# EAGLE design tiny (EAGLE 6.1)

## Sheet 1 of 2
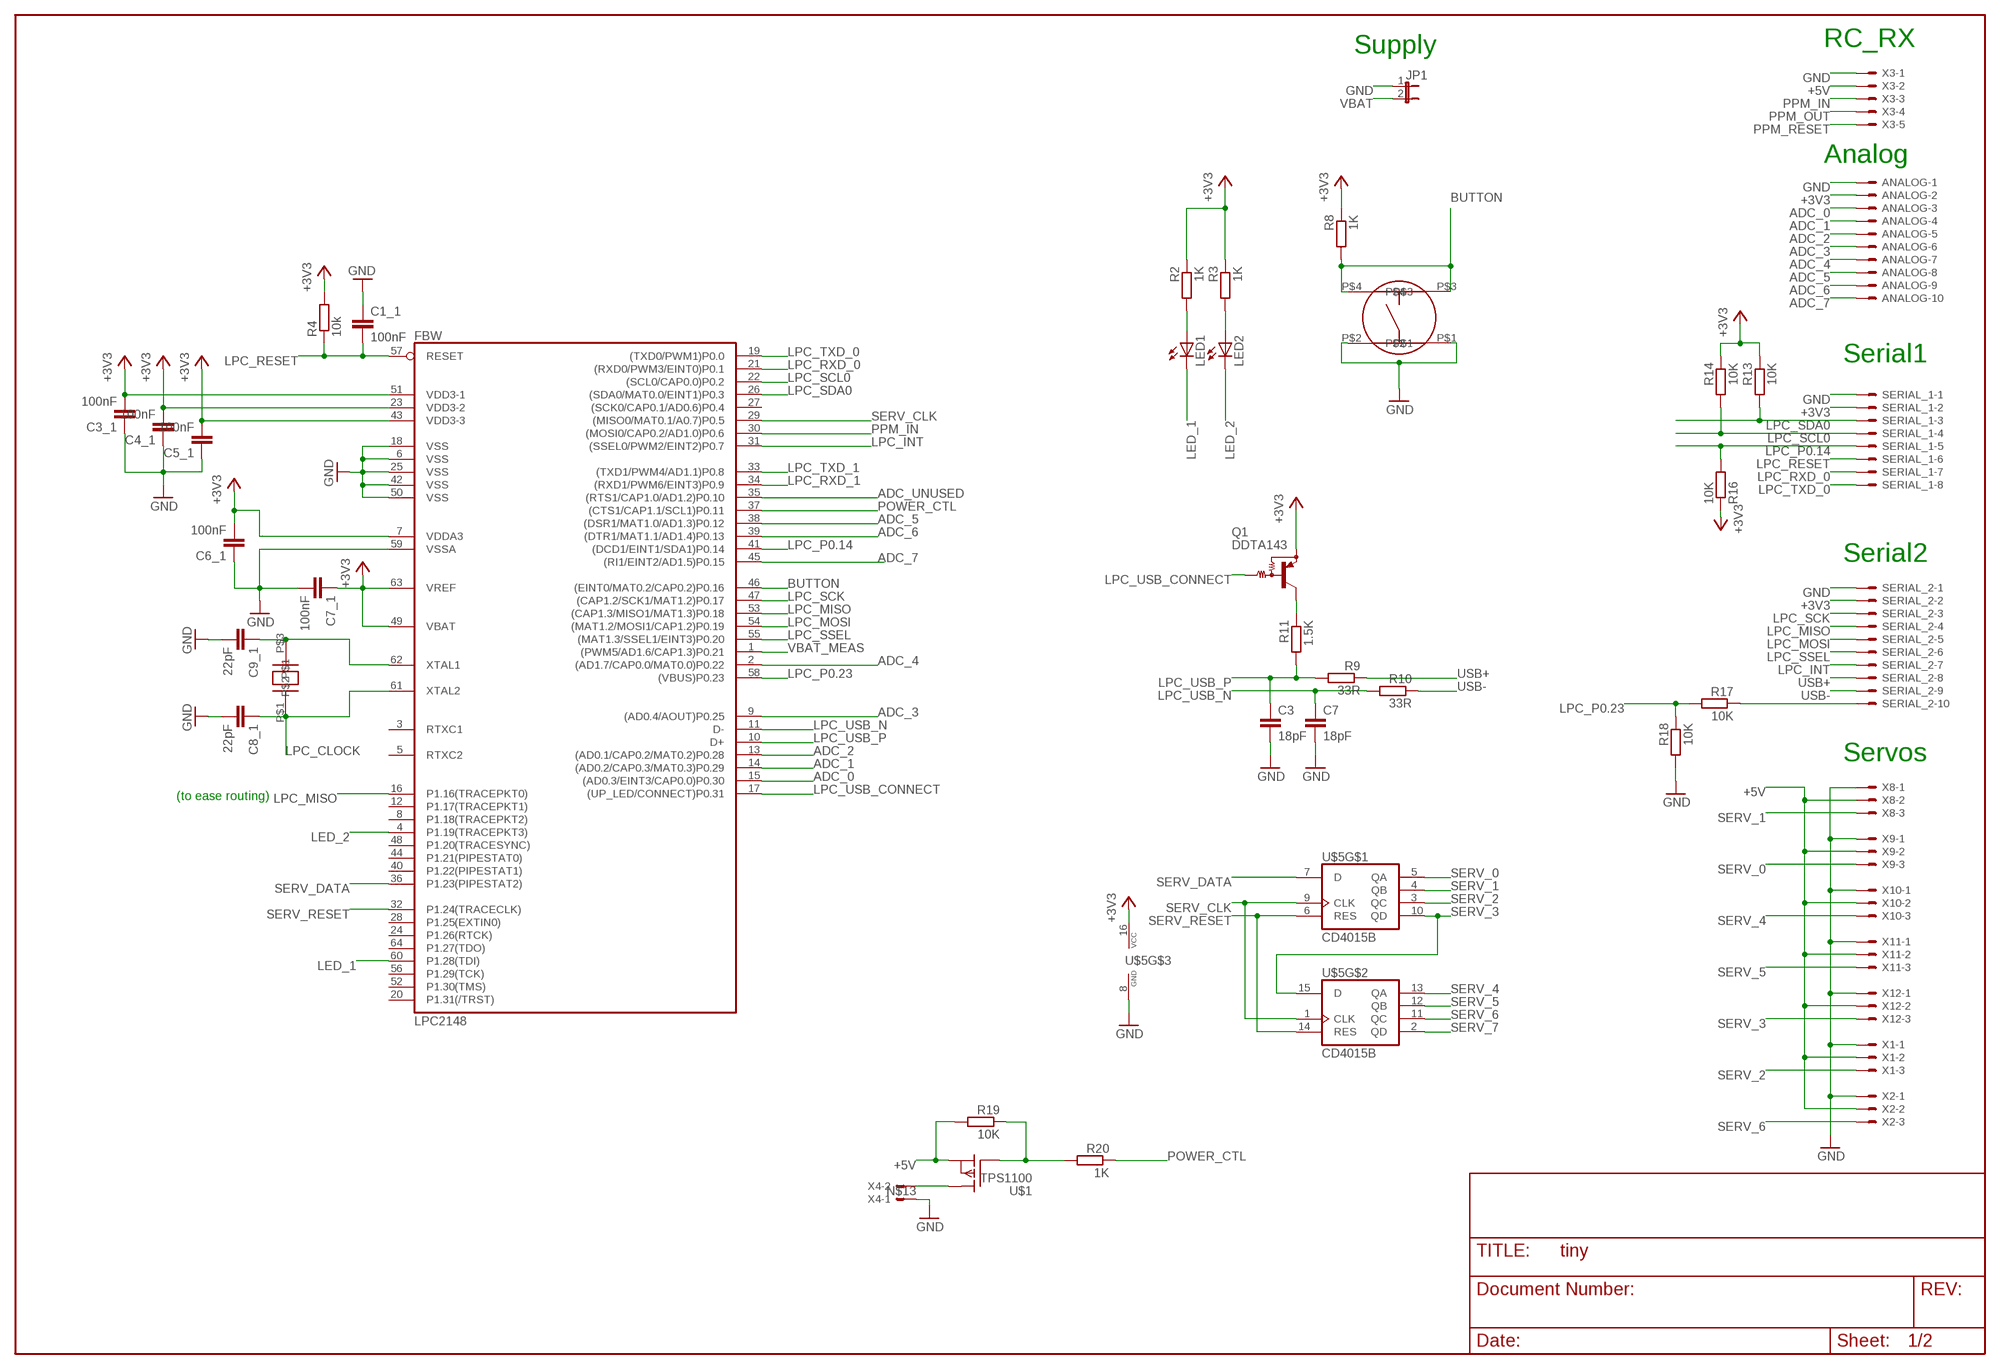
[diagram p0: schematic, sheet 1]

### Parts
ANALOG  53047-10  [53047-10]
C1_1  100nF  C-EUC0402K  [C0402K]
C3  18pF  C-EUC0402K  [C0402K]
C3_1  100nF  C-EUC0402K  [C0402K]
C4_1  100nF  C-EUC0402K  [C0402K]
C5_1  100nF  C-EUC0402K  [C0402K]
C6_1  100nF  C-EUC0402K  [C0402K]
C7  18pF  C-EUC0402K  [C0402K]
C7_1  100nF  C-EUC0402K  [C0402K]
C8_1  22pF  C-EUC0402K  [C0402K]
C9_1  22pF  C-EUC0402K  [C0402K]
FBW  LPC2148  [SQFP-S-10X10-64]
JP1  JP1E  [JP1]
LED1  LEDCHIP-LED0805  [CHIP-LED0805]
LED2  LEDCHIP-LED0805  [CHIP-LED0805]
Q1  DDTA143  MUN2111T1  [SC59-BEC]
R2  1K  R-EU_R1005  [R1005]
R3  1K  R-EU_R1005  [R1005]
R4  10k  R-EU_R1005  [R1005]
R8  1K  R-EU_R1005  [R1005]
R9  33R  R-EU_R1005  [R1005]
R10  33R  R-EU_R1005  [R1005]
R11  1.5K  R-EU_R1005  [R1005]
R13  10K  R-EU_R1005  [R1005]
R14  10K  R-EU_R1005  [R1005]
R16  10K  R-EU_R1005  [R1005]
R17  10K  R-EU_R1005  [R1005]
R18  10K  R-EU_R1005  [R1005]
R19  10K  R-EU_R1005  [R1005]
R20  1K  R-EU_R1005  [R1005]
SERIAL_1  53047-08  [53047-08]
SERIAL_2  53047-10  [53047-10]
SW1  B3S  [B3S]
U$1  TPS1100  [SOIC8]
U$5  CD4015B  [TSSOP16]
U$19  CRYSTAL_CTS  [CTS_CRYSTAL]
X1  53047-03  [53047-03]
X2  53047-03  [53047-03]
X3  53047-05  [53047-05]
X4  53047-02  [53047-02]
X8  53047-03  [53047-03]
X9  53047-03  [53047-03]
X10  53047-03  [53047-03]
X11  53047-03  [53047-03]
X12  53047-03  [53047-03]

### Nets
+3V3: ANALOG.2 C3_1.2 C4_1.2 C5_1.2 C6_1.2 C7_1.1 FBW.7(VDDA3) FBW.23(VDD3-2) FBW.43(VDD3-3) FBW.49(VBAT) FBW.51(VDD3-1) FBW.63(VREF) Q1.E R2.1 R3.1 R4.2 R8.1 R13.1 R14.1 R16.1 SERIAL_1.2 SERIAL_2.2 U$5.16(VCC) ; also sheet 2
+5V: R19.2 U$1.1(S) X1.2 X2.2 X3.2 X8.2 X9.2 X10.2 X11.2 X12.2 ; also sheet 2
ADC_0: ANALOG.3 FBW.15((AD0.3/EINT3/CAP0.0)P0.30)
ADC_1: ANALOG.4 FBW.14((AD0.2/CAP0.3/MAT0.3)P0.29)
ADC_2: ANALOG.5 FBW.13((AD0.1/CAP0.2/MAT0.2)P0.28)
ADC_3: ANALOG.6 FBW.9((AD0.4/AOUT)P0.25)
ADC_4: ANALOG.7 FBW.2((AD1.7/CAP0.0/MAT0.0)P0.22)
ADC_5: ANALOG.8 FBW.38((DSR1/MAT1.0/AD1.3)P0.12)
ADC_6: ANALOG.9 FBW.39((DTR1/MAT1.1/AD1.4)P0.13)
ADC_7: ANALOG.10 FBW.45((RI1/EINT2/AD1.5)P0.15)
ADC_UNUSED: FBW.35((RTS1/CAP1.0/AD1.2)P0.10)
BUTTON: FBW.46((EINT0/MAT0.2/CAP0.2)P0.16) R8.2 SW1.P$3 SW1.P$4
GND: ANALOG.1 C1_1.1 C3.2 C3_1.1 C4_1.1 C5_1.1 C6_1.1 C7.2 C7_1.2 C8_1.2 C9_1.2 FBW.6(VSS) FBW.18(VSS) FBW.25(VSS) FBW.42(VSS) FBW.50(VSS) FBW.59(VSSA) JP1.1 R18.2 SERIAL_1.1 SERIAL_2.1 SW1.P$1 SW1.P$2 U$5.8(GND) X1.1 X2.1 X3.1 X4.1 X8.1 X9.1 X10.1 X11.1 X12.1 ; also sheet 2
LED_1: FBW.60(P1.28(TDI)) LED1.C
LED_2: FBW.4(P1.19(TRACEPKT3)) LED2.C
LPC_CLOCK: C8_1.1 FBW.61(XTAL2) U$19.P$1
LPC_INT: FBW.31((SSEL0/PWM2/EINT2)P0.7) SERIAL_2.7
LPC_MISO: FBW.16(P1.16(TRACEPKT0)) FBW.53((CAP1.3/MISO1/MAT1.3)P0.18) SERIAL_2.4
LPC_MOSI: FBW.54((MAT1.2/MOSI1/CAP1.2)P0.19) SERIAL_2.5
LPC_P0.14: FBW.41((DCD1/EINT1/SDA1)P0.14) R16.2 SERIAL_1.5
LPC_P0.23: FBW.58((VBUS)P0.23) R17.2 R18.1
LPC_RESET: C1_1.2 FBW.57(RESET) R4.1 SERIAL_1.6
LPC_RXD_0: FBW.21((RXD0/PWM3/EINT0)P0.1) SERIAL_1.7
LPC_RXD_1: FBW.34((RXD1/PWM6/EINT3)P0.9) ; also sheet 2
LPC_SCK: FBW.47((CAP1.2/SCK1/MAT1.2)P0.17) SERIAL_2.3
LPC_SCL0: FBW.22((SCL0/CAP0.0)P0.2) R14.2 SERIAL_1.4
LPC_SDA0: FBW.26((SDA0/MAT0.0/EINT1)P0.3) R13.2 SERIAL_1.3
LPC_SSEL: FBW.55((MAT1.3/SSEL1/EINT3)P0.20) SERIAL_2.6
LPC_TXD_0: FBW.19((TXD0/PWM1)P0.0) SERIAL_1.8
LPC_TXD_1: FBW.33((TXD1/PWM4/AD1.1)P0.8) ; also sheet 2
LPC_USB_CONNECT: FBW.17((UP_LED/CONNECT)P0.31) Q1.B
LPC_USB_N: C7.1 FBW.11(D-) R10.2
LPC_USB_P: C3.1 FBW.10(D+) R9.2 R11.2
N$4: R17.1 SERIAL_2.10
N$5: C9_1.1 FBW.62(XTAL1) U$19.P$3
N$7: Q1.C R11.1
N$11: R19.1 R20.2 U$1.4(G)
N$13: U$1.5(D) X4.2
N$21: LED1.A R2.2
N$22: LED2.A R3.2
POWER_CTL: FBW.37((CTS1/CAP1.1/SCL1)P0.11) R20.1
PPM_IN: FBW.30((MOSI0/CAP0.2/AD1.0)P0.6) X3.3
PPM_OUT: X3.4
PPM_RESET: X3.5
SERV_0: U$5.5(QA) X9.3
SERV_1: U$5.4(QB) X8.3
SERV_2: U$5.3(QC) X1.3
SERV_3: U$5.10(QD) U$5.15(D) X12.3
SERV_4: U$5.13(QA) X10.3
SERV_5: U$5.12(QB) X11.3
SERV_6: U$5.11(QC) X2.3
SERV_7: U$5.2(QD)
SERV_CLK: FBW.29((MISO0/MAT0.1/A0.7)P0.5) U$5.1(CLK) U$5.9(CLK)
SERV_DATA: FBW.36(P1.23(PIPESTAT2)) U$5.7(D)
SERV_RESET: FBW.32(P1.24(TRACECLK)) U$5.6(RES) U$5.14(RES)
USB+: R9.1 SERIAL_2.8
USB-: R10.1 SERIAL_2.9
VBAT: JP1.2 ; also sheet 2
VBAT_MEAS: FBW.1((PWM5/AD1.6/CAP1.3)P0.21) ; also sheet 2
Unconnected: FBW.3(RTXC1) FBW.5(RTXC2) FBW.8(P1.18(TRACEPKT2)) FBW.12(P1.17(TRACEPKT1)) FBW.20(P1.31(/TRST)) FBW.24(P1.26(RTCK)) FBW.27((SCK0/CAP0.1/AD0.6)P0.4) FBW.28(P1.25(EXTIN0)) FBW.40(P1.22(PIPESTAT1)) FBW.44(P1.21(PIPESTAT0)) FBW.48(P1.20(TRACESYNC)) FBW.52(P1.30(TMS)) FBW.56(P1.29(TCK)) FBW.64(P1.27(TDO)) U$1.2(S1) U$1.3(S2) U$1.6(D1) U$1.7(D2) U$1.8(D3)

### Notes on the sheet
- Supply | RC_RX
- Analog
- Serial1
- Serial2
- Servos
- (to ease routing)

## Sheet 2 of 2
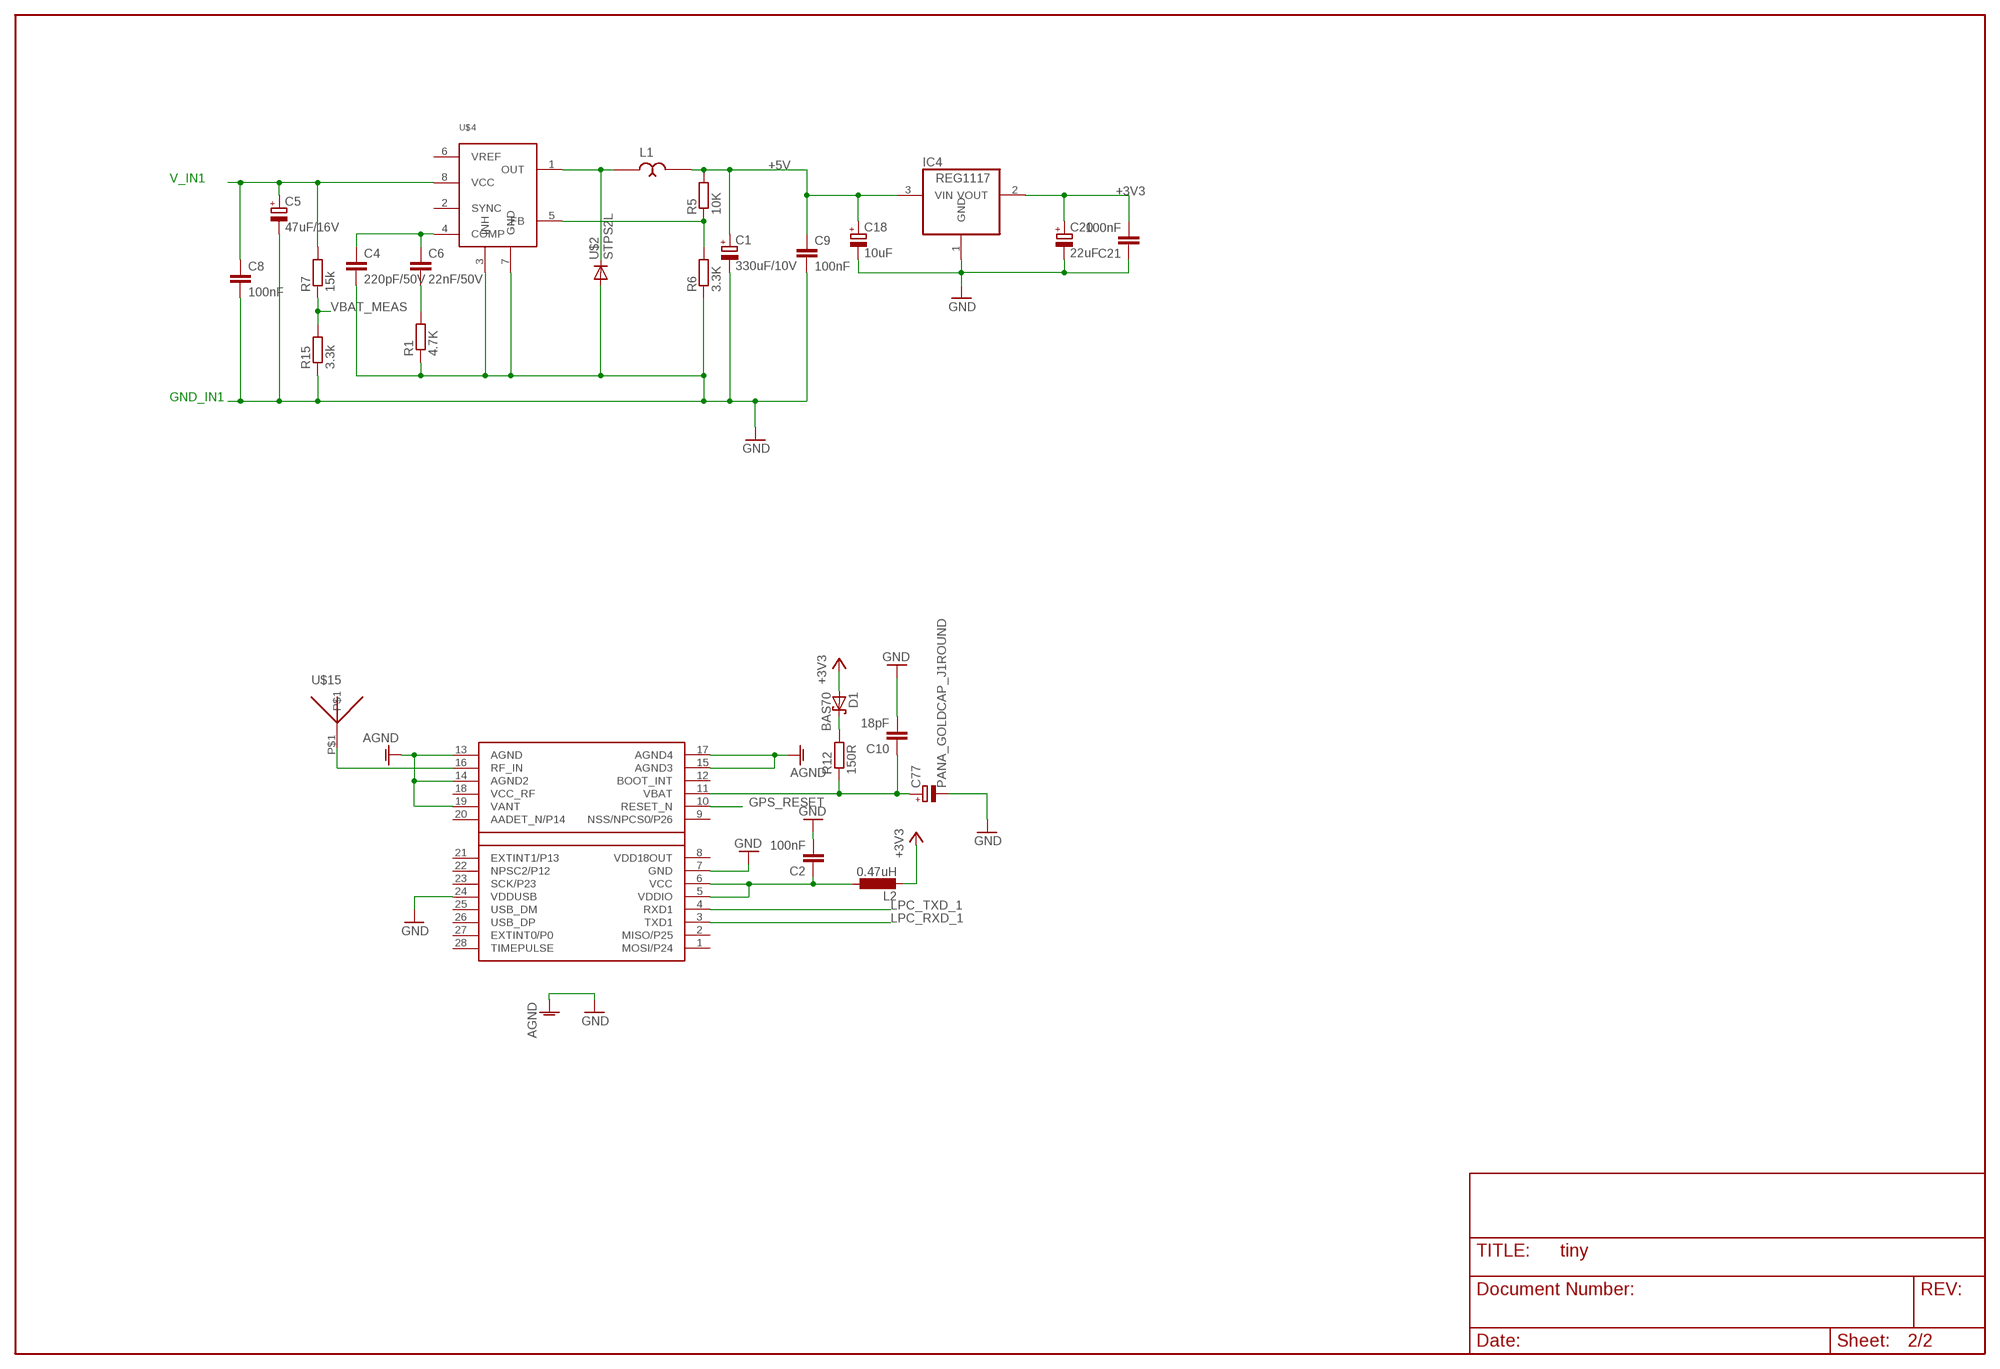
[diagram p1: schematic, sheet 2]

### Parts
C1  330uF/10V  CPOL-EUD/7343-31R  [D/7343-31R]
C2  100nF  C-EUC0402K  [C0402K]
C4  220pF/50V  C-EUC1206K  [C1206K]
C5  47uF/16V  CPOL-EUD/7343-31R  [D/7343-31R]
C6  22nF/50V  C-EUC1206K  [C1206K]
C8  100nF  C-EUC0603  [C0603]
C9  100nF  C-EUC0603  [C0603]
C10  18pF  C-EUC0402K  [C0402K]
C18  10uF  CPOL-EUA/3216-18R  [A/3216-18R]
C20  22uF  CPOL-EUB/3528-21R  [B/3528-21R]
C21  100nF  C-EUC0603  [C0603]
C77  PANA_GOLDCAP_J1ROUND  [PANA_J1_BIS]
D1  BAS70  [SOT23]
IC4  REG1117  [SOT223]
L1  15uH  WE_PD  [WE_PD]
L2  0.47uH  L-EUL2012C  [L2012C]
R1  4.7K  R-EU_R1005  [R1005]
R5  10K  R-EU_R1005  [R1005]
R6  3.3K  R-EU_R1005  [R1005]
R7  15k  R-EU_R1005  [R1005]
R12  150R  R-EU_R1005  [R1005]
R15  3.3k  R-EU_R1005  [R1005]
U$2  STPS2L  [SMA]
U$4  L5973D  [SO08]
U$6  LEA-4P  [LEA-LA]
U$15  GPS_ANT_13  [GPS_ANT_13]

### Nets
+3V3: C20.+ C21.2 D1.1(A) IC4.2(VOUT) L2.2 ; also sheet 1
+5V: C1.+ C9.1 C18.+ IC4.3(VIN) L1.P$2 R5.2 ; also sheet 1
GND: C1.- C2.2 C4.2 C5.- C8.2 C9.2 C10.2 C18.- C20.- C21.1 C77.MINUS(-) IC4.1(GND) R1.1 R6.1 R15.1 U$2.P$1(A) U$4.3(INH) U$4.7(GND) U$6.7(GND) U$6.13(AGND) U$6.14(AGND2) U$6.15(AGND3) U$6.17(AGND4) U$6.19(VANT) U$6.24(VDDUSB) ; supply symbol labelled AGND ; also sheet 1
GPS_RESET: U$6.10(RESET_N)
LPC_RXD_1: U$6.3(TXD1) ; also sheet 1
LPC_TXD_1: U$6.4(RXD1) ; also sheet 1
N$1: C2.1 L2.1 U$6.5(VDDIO) U$6.6(VCC)
N$3: U$6.16(RF_IN) U$15.P$1
N$6: C4.1 C6.1 U$4.4(COMP)
N$8: C6.2 R1.2
N$9: L1.P$1 U$2.P$2(C) U$4.1(OUT)
N$10: R5.1 R6.2 U$4.5(FB)
N$28: C10.1 C77.PLUS(+) R12.1 U$6.11(VBAT)
N$29: D1.3(C) R12.2
VBAT: C5.+ C8.1 R7.2 U$4.8(VCC) ; also sheet 1
VBAT_MEAS: R7.1 R15.2 ; also sheet 1
Unconnected: U$4.2(SYNC) U$4.6(VREF) U$6.1(MOSI/P24) U$6.2(MISO/P25) U$6.9(NSS/NPCS0/P26) U$6.12(BOOT_INT) U$6.20(AADET_N/P14) U$6.21(EXTINT1/P13) U$6.22(NPSC2/P12) U$6.23(SCK/P23) U$6.25(USB_DM) U$6.26(USB_DP) U$6.27(EXTINT0/P0) U$6.28(TIMEPULSE)

### Notes on the sheet
- V_IN1
- GND_IN1

## Power pins joined to a net without a drawn wire
VCC_RF: U$6.18(VCC_RF)
VDD18OUT: U$6.8(VDD18OUT)

## Library data of the parts
ANALOG SERIAL_2 = con-molex:53?-10: CONNECTOR wire to board 1.25 mm (.049 inch) pitch header
C1 C5 C18 C20 = rcl:CPOL-EU: POLARIZED CAPACITOR, European symbol
C1_1 C2 C3 C3_1 C4 C4_1 C5_1 C6 C6_1 C7 C7_1 C8 C8_1 C9 C9_1 C10 C21 = rcl:C-EU: CAPACITOR, European symbol
C77 = paparazzi:PANA_GOLDCAP_J1
D1 = diode:BAS70: Silicon Schottky Diodes General-purpose diode for high-speed switching
FBW = paparazzi:LPC2148
IC4 = burr-brown:REG1117: 800mA and 1A Low Dropout (LDO) Positive Regulator 1.8V, 2.5V, 2.85V, 3.3V, 5V, and Adj
JP1 = jumper:JP1E: JUMPER
L1 = paparazzi:WE_PD
L2 = rcl:L-EU: INDUCTOR, European symbol
LED1 LED2 = led:LED: LED OSRAM: - CHIPLED LG R971, LG N971, LY N971, LG Q971, LY Q971, LO R971, LY R971 LH N974, LH R974 LS Q976, LO Q976, LY Q976 LO Q996 - Hyper CHIPLED LW Q18S LB Q993, LB Q99A, LB R99A - SideLED LS A670, LO A670, LY A670, LG A670, LP A670 LB A673, LV A673, LT A673, LW A673 LH A674 LY A675 LS A676, LA A676, LO A676, LY A676, LW A676 LS A679, LY A679, LG A679 - Hyper Micro SIDELED® LS Y876, LA Y876, LO Y876, LY Y876 LT Y87S - SmartLED LW L88C, LW L88S LB L89C, LB L89S, LG L890 LS L89K, LO L89K, LY L89K LS L896, LA L896, LO L896, LY L896 - TOPLED LS T670, LO T670, LY T670, LG T670, LP T670 LSG T670, LSP T670, LSY T670, LOP T670, LYG T670 LG T671, LOG T671, LSG T671 LB T673, LV T673, LT T673, LW T673 LH T674 LS T676, LA T676, LO T676, LY T676, LB T676, LH T676, LSB T676, LW T676 LB T67C, LV T67C, LT T67C, LS T67K, LO T67K, LY T67K, LW E67C LS E67B, LA E67B, LO E67B, LY E67B, LB E67C, LV E67C, LT E67C LW T67C LS T679, LY T679, LG T679 LS T770, LO T770, LY T770, LG T770, LP T770 LB T773, LV T773, LT T773, LW T773 LH T774 LS E675, LA E675, LY E675, LS T675 LS T776, LA T776, LO T776, LY T776, LB T776 LHGB T686 LT T68C, LB T68C - Hyper Mini TOPLED® LB M676 - Mini TOPLED Santana® LG M470 LS M47K, LO M47K, LY M47K Source: http://www.osram.convergy.de/
Q1 = transistor-pnp:MUN2111*: PNP Bias Resistor Transistor
R1-R20 = rcl:R-EU_: RESISTOR, European symbol
SERIAL_1 = con-molex:53?-08: CONNECTOR wire to board 1.25 mm (.049 inch) pitch header
SW1 = paparazzi:B3S
U$1 = paparazzi:TPS1100
U$2 = paparazzi:STPS2L
U$4 = paparazzi:L5973D
U$5 = paparazzi:CD4015B
U$6 = paparazzi:LEA-4P
U$15 = paparazzi:GPS_ANT_13: Sangshin KSA-ST1575MS13
U$19 = paparazzi:CRYSTAL_CTS
X1 X2 X8-X12 = con-molex:53?-03: CONNECTOR wire to board 1.25 mm (.049 inch) pitch header
X3 = con-molex:53?-05: CONNECTOR wire to board 1.25 mm (.049 inch) pitch header
X4 = con-molex:53?-02: CONNECTOR wire to board 1.25 mm (.049 inch) pitch header

## Board
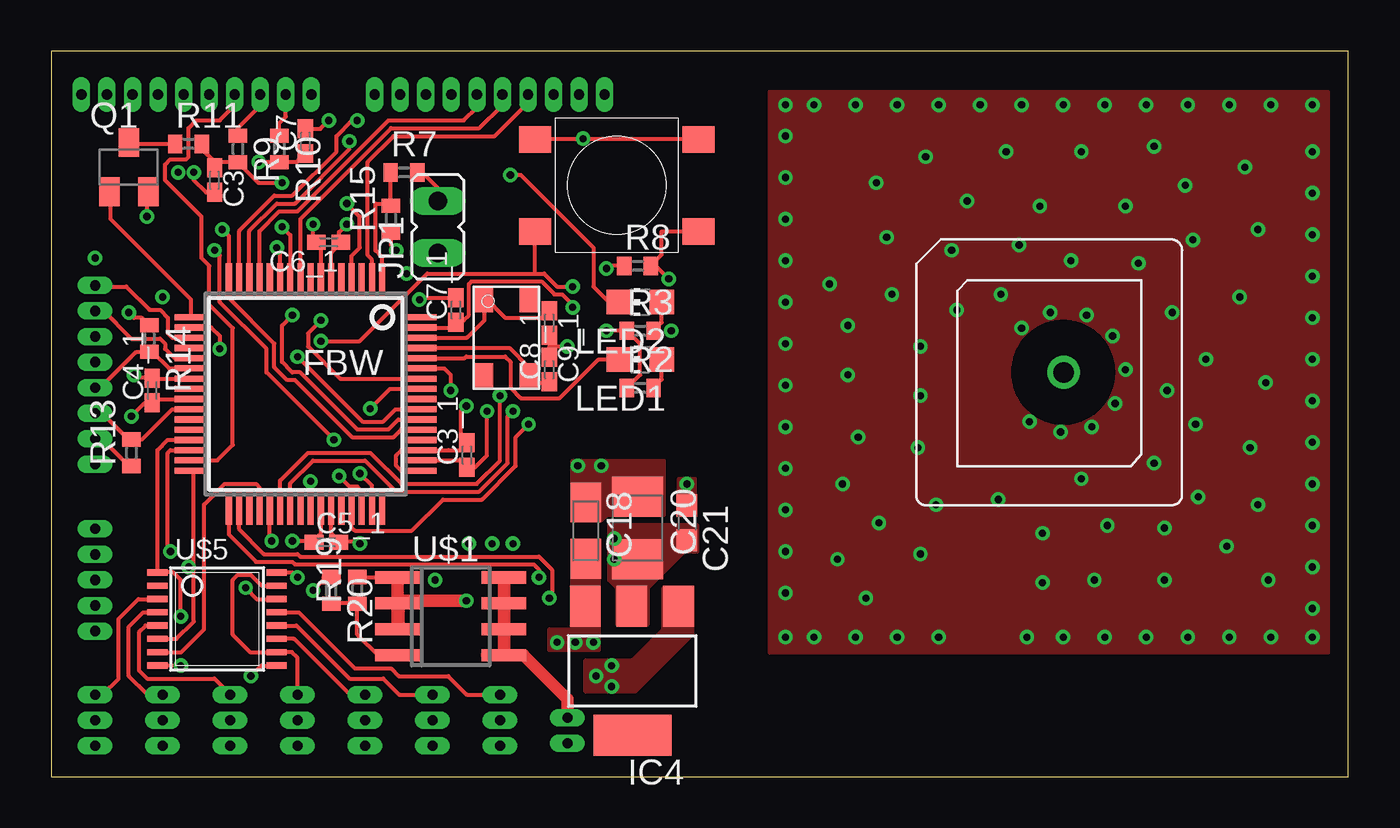
[diagram p2: board, top side]
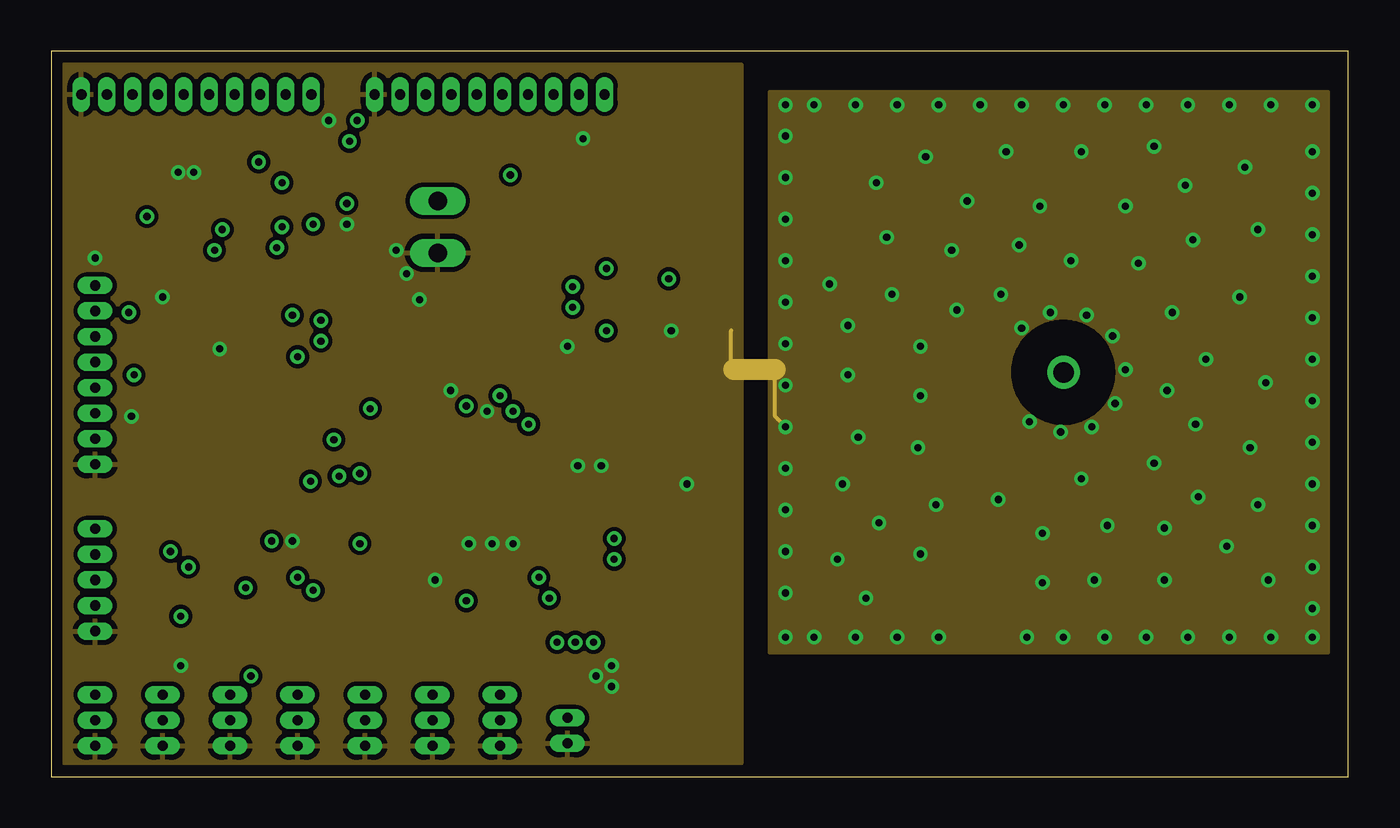
[diagram p3: board, inner layer Route2]
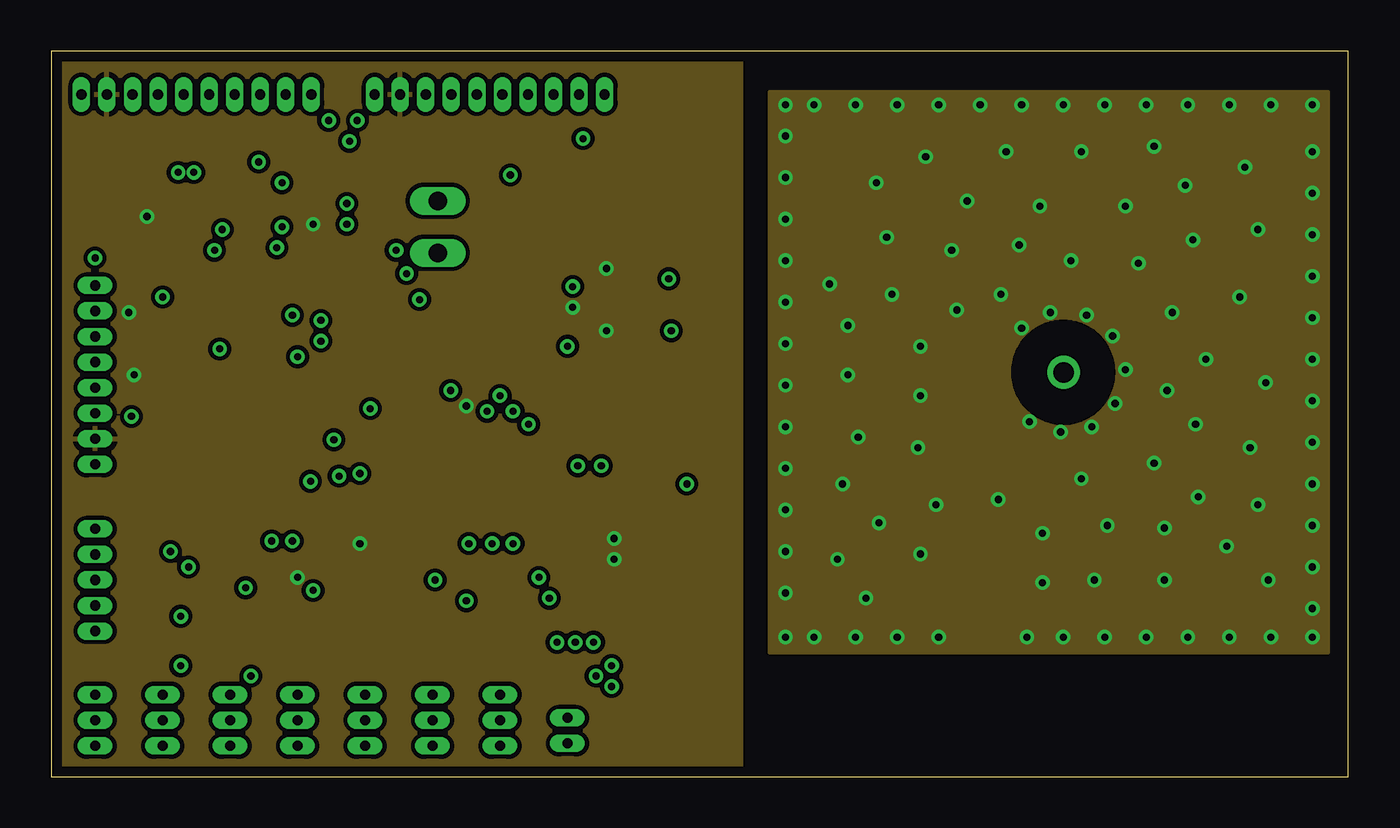
[diagram p4: board, inner layer Route15]
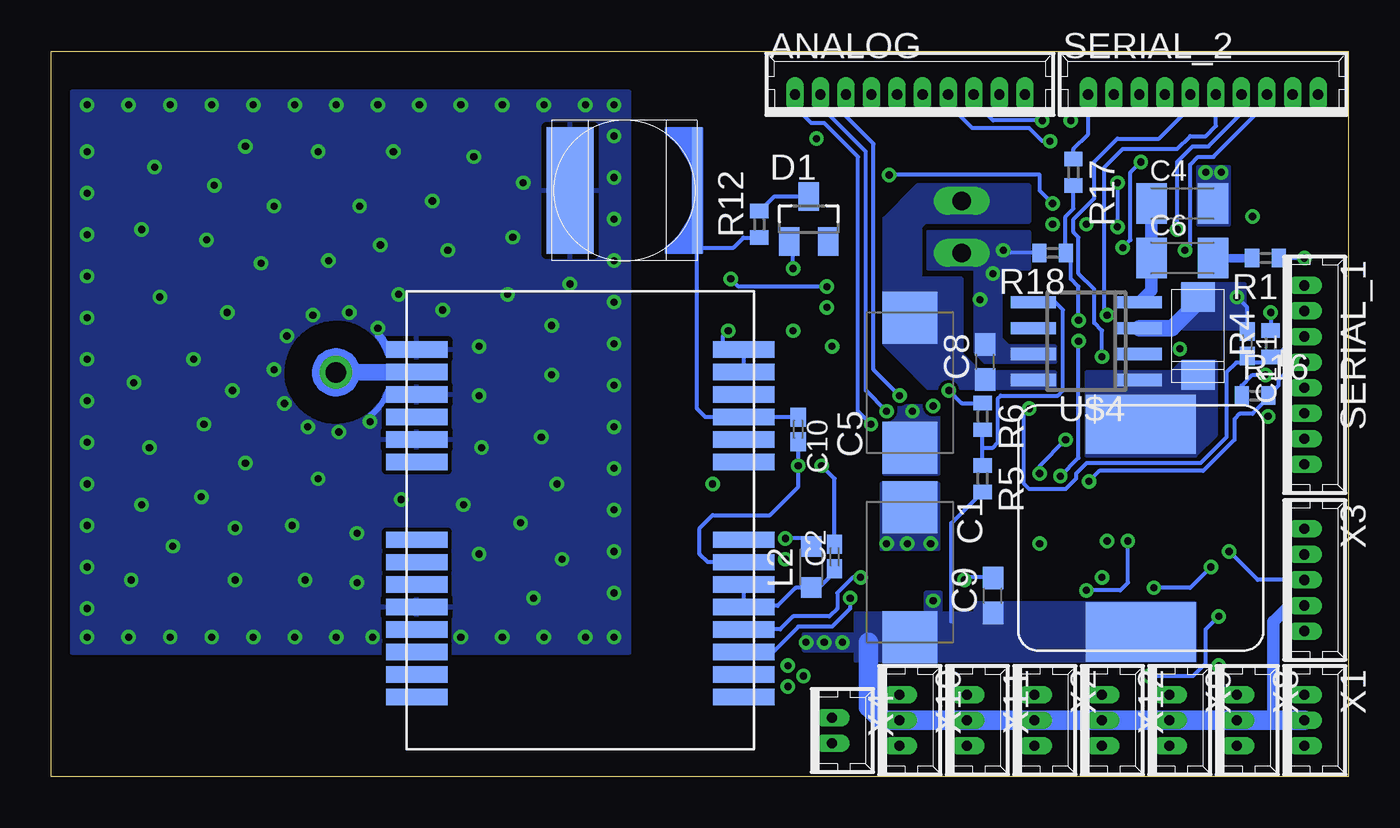
[diagram p5: board, bottom side, seen from below]

Size 63.48 x 35.48 mm. Coordinates in mm from the lower left corner, seen from the top.
Outline: 0,0 63.48,0 63.48,35.48 0,35.48 0,0
Copper layers (1*2+15*16): Top 0.035mm / dielectric 0.2mm / Route2 0.035mm / dielectric 1.5mm / Route15 0.035mm / dielectric 0.2mm / Bottom 0.035mm
Design rules: minimum track width 0.15mm, minimum drill 0.35mm, track to track 0.15mm, track to pad 0.15mm, pad to pad 0.15mm, via to via 0.15mm, smd to smd 0.15mm, copper to edge 20mil, drill to drill 8mil, minimum pad ring 0.177mm, minimum via ring 0.177mm, stop-mask expansion 4mil, vias tented up to drill 0mil, thermal gap 10mil
tRestrict: area 47.5,17.8 to 51.6,21.8; area 48.2,18.4 to 50.9,21.2
bRestrict: 4 lines

### Footprints (pad centres in the part's own frame; a part is rotated, then mirrored left to right if it is on the bottom)
53047-10 = drill 0.5 pad 0.698 long: 1 5.625,0; 2 4.375,0; 3 3.125,0; 4 1.875,0; 5 0.625,0; 6 -0.625,0; 7 -1.875,0; 8 -3.125,0; 9 -4.375,0; 10 -5.625,0
D/7343-31R = smd 2.55 x 2.7: + 3.175,0; - -3.175,0
C0402K = smd 0.925 x 0.74: 1 -0.6,0; 2 0.6,0
C1206K = smd 1.5 x 2: 1 -1.5,0; 2 1.5,0
C0603 = smd 1.1 x 1: 1 -0.85,0; 2 0.85,0
A/3216-18R = smd 1.95 x 1.5: + 1.375,0; - -1.375,0
B/3528-21R = smd 1.95 x 2.5: + 1.525,0; - -1.525,0
PANA_J1_BIS = smd 6.2 x 2.3: MINUS 0,-2.794 | smd 6.198 x 0.508: PLUS 0,3.429
SOT23 = smd 1 x 1.4: 1 -0.95,-1.1; 2 0.95,-1.1; 3 0,1.1
SQFP-S-10X10-64 = smd 0.3 x 1.6: 1 -3.75,-5.6; 2 -3.25,-5.6; 3 -2.75,-5.6; 4 -2.25,-5.6; 5 -1.75,-5.6; 6 -1.25,-5.6; 7 -0.75,-5.6; 8 -0.25,-5.6; 9 0.25,-5.6; 10 0.75,-5.6; 11 1.25,-5.6; 12 1.75,-5.6; 13 2.25,-5.6; 14 2.75,-5.6; 15 3.25,-5.6; 16 3.75,-5.6; 33 3.75,5.6; 34 3.25,5.6; 35 2.75,5.6; 36 2.25,5.6; 37 1.75,5.6; 38 1.25,5.6; 39 0.75,5.6; 40 0.25,5.6; 41 -0.25,5.6; 42 -0.75,5.6; 43 -1.25,5.6; 44 -1.75,5.6; 45 -2.25,5.6; 46 -2.75,5.6; 47 -3.25,5.6; 48 -3.75,5.6 | smd 1.6 x 0.3: 17 5.6,-3.75; 18 5.6,-3.25; 19 5.6,-2.75; 20 5.6,-2.25; 21 5.6,-1.75; 22 5.6,-1.25; 23 5.6,-0.75; 24 5.6,-0.25; 25 5.6,0.25; 26 5.6,0.75; 27 5.6,1.25; 28 5.6,1.75; 29 5.6,2.25; 30 5.6,2.75; 31 5.6,3.25; 32 5.6,3.75; 49 -5.6,3.75; 50 -5.6,3.25; 51 -5.6,2.75; 52 -5.6,2.25; 53 -5.6,1.75; 54 -5.6,1.25; 55 -5.6,0.75; 56 -5.6,0.25; 57 -5.6,-0.25; 58 -5.6,-0.75; 59 -5.6,-1.25; 60 -5.6,-1.75; 61 -5.6,-2.25; 62 -5.6,-2.75; 63 -5.6,-3.25; 64 -5.6,-3.75
SOT223 = smd 1.499 x 2.007: 1 -2.261,-3.15; 2 0.025,-3.15; 3 2.311,-3.15 | smd 3.81 x 2.007: 4 0,3.15
JP1 = drill 0.914 long: 1 0,-1.27; 2 0,1.27
WE_PD = smd 2.9 x 5.4: P$1 -5.08,0; P$2 5.08,0
L2012C = smd 1 x 1: 1 -1,0; 2 1,0
CHIP-LED0805 = smd 1.2 x 1.2: A 0,-1.05; C 0,1.05
SC59-BEC = smd 1 x 1.4: B -0.95,-1.2; C 0,1.2; E 0.95,-1.2
R1005 = smd 0.7 x 0.9: 1 -0.65,0; 2 0.65,0
53047-08 = drill 0.5 pad 0.698 long: 1 4.375,0; 2 3.125,0; 3 1.875,0; 4 0.625,0; 5 -0.625,0; 6 -1.875,0; 7 -3.125,0; 8 -4.375,0
B3S = smd 1.55 x 1.3: P$1 4,-2.25; P$2 -4,-2.25; P$3 4,2.25; P$4 -4,2.25
SOIC8 = smd 0.6 x 2.2: 1 -1.905,-2.6; 2 -0.635,-2.6; 3 0.635,-2.6; 4 1.905,-2.6; 5 1.905,2.6; 6 0.635,2.6; 7 -0.635,2.6; 8 -1.905,2.6
SMA = smd 1.45 x 1.65: P$1 -1.905,0; P$2 1.905,0
SO08 = smd 0.6 x 2.2: 1 -1.905,-2.6; 2 -0.635,-2.6; 3 0.635,-2.6; 4 1.905,-2.6; 5 1.905,2.6; 6 0.635,2.6; 7 -0.635,2.6; 8 -1.905,2.6
TSSOP16 = smd 0.305 x 0.991: 1 -2.275,-2.918; 2 -1.625,-2.918; 3 -0.975,-2.918; 4 -0.325,-2.918; 5 0.325,-2.918; 6 0.975,-2.918; 7 1.625,-2.918; 8 2.275,-2.918; 9 2.275,2.918; 10 1.625,2.918; 11 0.975,2.918; 12 0.325,2.918; 13 -0.325,2.918; 14 -0.975,2.918; 15 -1.625,2.918; 16 -2.275,2.918
LEA-LA = smd 3 x 0.8: 1 8,-8.65; 2 8,-7.55; 3 8,-6.45; 4 8,-5.35; 5 8,-4.25; 6 8,-3.15; 7 8,-2.05; 8 8,-0.95; 9 8,2.85; 10 8,3.95; 11 8,5.05; 12 8,6.15; 13 8,7.25; 14 8,8.35; 15 -8,8.35; 16 -8,7.25; 17 -8,6.15; 18 -8,5.05; 19 -8,3.95; 20 -8,2.85; 21 -8,-0.95; 22 -8,-2.05; 23 -8,-3.15; 24 -8,-4.25; 25 -8,-5.35; 26 -8,-6.45; 27 -8,-7.55; 28 -8,-8.65
GPS_ANT_13 = drill 1 pad 1.6: P$1 0,-0.7
CTS_CRYSTAL = smd 1.2 x 0.9: P$1 -1.85,-1.1; P$2 1.85,-1.1; P$3 1.85,1.1; P$4 -1.85,1.1
53047-03 = drill 0.5 pad 0.698 long: 1 1.25,0; 2 0,0; 3 -1.25,0
53047-05 = drill 0.5 pad 0.698 long: 1 2.5,0; 2 1.25,0; 3 0,0; 4 -1.25,0; 5 -2.5,0
53047-02 = drill 0.5 pad 0.698 long: 1 0.625,0; 2 -0.625,0

### Placement (x,y rotation side)
ANALOG  21.46,33.36 0 bottom
C1  21.46,10 270 bottom
C1_1  4.95,21.17 270 bottom
C2  25.14,10.76 90 bottom
C3  8,29.17 270 top
C3_1  20.34,15.72 90 top
C4  8.12,28.03 0 bottom
C4_1  4.95,18.89 90 top
C5  21.46,19.27 90 bottom
C5_1  13.46,11.46 0 top
C6  8.12,25.36 0 bottom
C6_1  13.58,26.13 180 top
C7  12.44,31.08 90 top
C7_1  19.81,22.82 90 top
C8  17.77,20.28 90 bottom
C8_1  24.38,19.9 90 top
C9  17.39,8.85 90 bottom
C9_1  24.38,22.19 270 top
C10  26.92,16.98 270 bottom
C18  26.16,12.03 270 top
C20  28.7,12.15 270 top
C21  31.11,12.41 270 top
C77  35.3,28.66 270 bottom
D1  26.41,27.27 0 bottom
FBW  12.45,18.71 180 top
IC4  28.44,5.17 180 top
JP1  18.92,26.89 0 top
L1  10.15,12.15 270 bottom
L2  26.28,10.25 90 bottom
LED1  28.82,20.41 90 top
LED2  28.82,23.2 90 top
Q1  3.8,29.81 0 top
R1  4.06,25.36 180 bottom
R2  28.82,19.01 0 top
R3  28.82,21.81 0 top
R4  3.8,21.17 90 bottom
R5  17.9,14.57 270 bottom
R6  17.9,17.61 270 bottom
R7  17.27,29.55 0 top
R8  28.7,24.98 0 top
R9  9.14,30.7 270 top
R10  11.17,30.7 270 top
R11  6.73,30.95 0 top
R12  28.82,27.01 90 bottom
R13  3.93,15.84 90 top
R14  4.82,21.43 270 top
R15  16.63,27.27 90 top
R16  4.57,18.63 0 bottom
R17  13.46,29.55 270 bottom
R18  14.47,25.62 180 bottom
R19  14.98,9.11 90 top
R20  13.71,9.11 270 top
SERIAL_1  2.15,19.65 270 bottom
SERIAL_2  7.11,33.36 0 bottom
SW1  27.68,28.92 180 top
U$1  19.55,7.84 270 top
U$2  7.36,21.55 270 bottom
U$4  12.82,21.3 90 bottom
U$5  8.12,7.71 270 top
U$6  37.59,12.54 0 bottom
U$15  48.84,19.77 90 top
U$19  22.27,21.47 90 top
X1  2.15,2.76 270 bottom
X2  15.36,2.76 270 bottom
X3  2.15,9.61 270 bottom
X4  25.27,2.25 270 bottom
X8  5.46,2.76 270 bottom
X9  8.76,2.76 270 bottom
X10  21.97,2.76 270 bottom
X11  18.66,2.76 270 bottom
X12  12.06,2.76 270 bottom

### Tracks (layer width: path | path; a pad name or v marks a point on that pad's centre or on a via)
+3V3  (via drill 0.35)
  Top 0.203: FBW.23 5,19.46 4.95,19.52 | 4.95,19.52 C4_1.2 | v3.8,22.7 4.06,22.44 4.44,22.44 4.82,22.06 R14.1 | 4.95,19.52 4.19,19.52 v4.06,19.65 | FBW.49 17.12,14.96 16.89,15.2 16.89,15.71 17.14,15.96 FBW.51 19.43,15.96 20.32,15.96 20.32,16.29 C3_1.2 | 12.82,26.12 12.85,26.12 | 12.82,26.12 v12.82,27.01 | 12.82,26.12 12.83,26.13 C6_1.2 12.96,26.13 12.95,26.12 13.2,25.87 FBW.7 | C3_1.2 20.57,16.32 | v27.17,21.81 R3.1 28.19,21.81 28.82,21.17 28.82,19.65 28.19,19.01 R2.1 | C3_1.2 20.32,16.35 20.06,16.35 20.06,17.87 v20.32,18.12 | v25.52,22.95 25.52,23.08 25.01,23.58 24.63,23.58 24,24.22 20.57,24.22 20.44,24.09 20.44,22.57 20.19,22.31 19.81,22.31 C7_1.1 19.81,22.19 19.58,21.96 FBW.63 | 28.06,24.98 R8.1 27.3,24.98 v27.17,24.85 | Q1.E 4.69,28.55 v4.69,27.39 | 3.93,15.2 R13.1 3.93,15.07 2.49,16.52 SERIAL_1.2 | U$5.16 11.82,9.98 v12.06,9.74 | 14.09,11.52 14.06,11.49 C5_1.2 14.09,11.49 14.09,11.52 | FBW.43 13.7,11.91 14.09,11.52 | v15.11,11.39 14.98,11.52 14.09,11.52
  Bottom 0.203: v3.8,22.7 R4.2 | R16.1 5.22,19.12 4.69,19.65 v4.06,19.65 | D1.1 27.34,26.17 27.17,26 v27.17,24.85 | L2.2 26.68,11.65 v27.55,11.65
  other vias: 27.55,10.63
  pour Route15 (isolate 0.203): 0.38,0.34 33.78,0.34 33.78,35.14 0.38,35.14
  pour Top (isolate 0.203, no thermals): 27.3,12.28 27.3,9.61 27.68,9.23 27.68,7.46 29.21,7.46 29.21,9.23 30.98,11.01 31.62,11.01 31.62,12.28
+5V  (via drill 0.35)
  Top 0.203: R19.2 15,9.74 U$1.1
  Top 0.61: U$1.1 16.95,7.2 17.01,7.2 17.01,8.6 v20.32,8.6
  Bottom 0.203: R5.2 19.43,12.39 19.43,7.58
  Bottom 0.61: X3.2 2.9,8.36 3.68,7.58 3.68,2.76
  Bottom 0.965: X11.2 X10.2 22.86,2.76 23.49,3.39 23.49,6.57 | 15.24,2.76 X2.2 X11.2 | X12.2 X11.2 | X12.2 X9.2 | X12.2 X8.2 3.68,2.76 X1.2
  other vias: 25.65,6.57 24.76,6.57 26.54,6.57
  pour Bottom (no thermals): 7.49,8.47 18.28,8.47 18.28,7.96 19.93,7.96 19.93,8.98 20.7,8.98 20.7,7.96 24.12,7.96 24.12,6.95 26.66,6.95 26.66,6.19 24.12,6.19 24.12,5.68 7.49,5.68
  pour Top (no thermals): 24.38,6.19 24.38,7.2 25.52,7.2 25.52,11.52 26.79,11.52 26.79,6.95 26.79,6.19
ADC_0  (via drill 0.35)
  Top 0.203: FBW.15 9.2,26.7 10.92,28.41 11.81,28.41 13.97,30.57 13.97,31.33 14.73,32.09 v14.98,32.09
  Bottom 0.203: v14.98,32.09 17.39,32.09 18.33,33.03 ANALOG.3
ADC_1  (via drill 0.35)
  Top 0.203: FBW.14 9.7,26.69 11.04,28.03 11.93,28.03 14.6,30.7 v14.6,31.08
  Bottom 0.203: ANALOG.4 19.58,32.89 18.41,31.71 15.62,31.71 14.98,31.08 v14.6,31.08
ADC_2
  Top 0.203: FBW.13 10.2,26.68 11.17,27.65 12.06,27.65 16.51,32.09 20.19,32.09 20.83,32.74 ANALOG.5
ADC_3
  Top 0.203: ANALOG.6 22.08,32.84 20.95,31.71 16.63,31.71 12.2,27.28 FBW.9
ADC_4
  Top 0.203: FBW.2 15.7,25.27 15.49,25.49 15.49,30.06 16.76,31.33 21.71,31.33 23.36,32.98 23.33,33.01 ANALOG.7
ADC_5  (via drill 0.35)
  Top 0.203: v21.97,18.63 21.97,15.46 20.82,14.31 17.14,14.31 15.62,15.84 12.57,15.84 11.2,14.47 FBW.38
  Bottom 0.203: v21.97,18.63 23.24,19.9 23.24,30.95 24.58,32.3 ANALOG.8
ADC_6  (via drill 0.35)
  Top 0.203: v22.6,17.87 22.35,17.61 22.35,15.33 20.95,13.93 16.89,13.93 15.36,15.46 12.82,15.46 11.7,14.34 FBW.39
  Bottom 0.203: v22.6,17.87 23.62,18.89 23.62,30.57 25.83,32.78 ANALOG.9
ADC_7  (via drill 0.35)
  Top 0.203: 23.24,17.11 v23.36,17.23 22.73,16.6 22.73,15.2 21.08,13.55 19.17,13.55 17.65,12.03 14.85,12.03 14.7,12.18 FBW.45
  Bottom 0.203: v23.36,17.23 24,17.87 24,30.32 25.65,31.97 26.28,31.97 27.08,32.77 ANALOG.10
BUTTON  (via drill 0.35)
  Top 0.203: FBW.46 15.2,13.96 14.98,14.19 14.6,14.19 v14.09,14.69 | v13.2,21.3 15.11,21.3 18.41,24.6 23.62,24.6 | SW1.P$4 29.88,26.67 29.88,25.53 29.33,24.98 R8.2 29.59,24.98 v30.22,24.35 | v25.52,23.96 24.76,23.96 24.12,24.6 23.62,24.6 | SW1.P$3 23.68,24.66 23.62,24.6
  Bottom 0.203: v14.09,14.69 13.2,15.58 v13.2,21.3 | v25.52,23.96 29.84,23.96 v30.22,24.35
GND  (via drill 0.35)
  Top 0.203: 14.22,26.12 14.09,26.12 | FBW.25 5.16,18.46 4.95,18.25 | 4.95,18.25 C4_1.1 | 4.95,18.25 4.57,18.25 v3.93,17.61 | 14.09,26.12 14.06,26.12 | v14.47,27.01 14.09,26.63 14.09,26.12 | FBW.59 19.24,19.96 19.55,19.65 v19.55,18.89 | FBW.50 20.32,15.46 20.32,15.12 C3_1.1 20.74,15.12 21.33,15.71 v21.33,17.87 | v8.25,20.92 8.25,21.55 7.84,21.96 FBW.18 | C9_1.2 24.38,21.04 | 24.38,21.04 C8_1.2 | 24.38,21.04 v25.27,21.04 | C7_1.2 18.12,23.42 v18.03,23.33 | R15.1 16.63,26 v16.89,25.74 | C7.2 13.17,31.68 v13.58,32.09 | U$5.8 6.33,5.43 v6.35,5.42 | 12.82,11.52 12.86,11.48 C5_1.1 12.82,11.5 12.82,11.52 | FBW.42 13.2,11.9 12.82,11.52 | 12.82,11.52 v11.81,11.52 | 14.22,26.12 14.21,26.13 C6_1.1 | FBW.6 13.7,25.61 14.22,26.12 | SW1.P$2 31.65,31.17 31.62,31.2 v26.03,31.2 23.62,31.2 23.65,31.17 SW1.P$1 | v6.98,29.55 6.98,29.17 7.58,28.57 C3.2
  Route2 0.203: 35.43,19.9 35.43,17.61 v35.94,17.11 | 33.4,19.9 33.27,20.03 33.27,21.81
  Route2 1.016: 35.43,19.9 33.4,19.9
  Bottom 0.203: v2.15,25.36 R1.1 | C1_1.1 4.95,22.95 v5.46,23.46 | 17.27,9.87 17.23,9.87 C9.2 17.39,9.74 18.66,9.74 v18.79,9.61 | R6.1 18.93,18.27 v19.55,18.89 | 29.59,20.92 U$6.14 | 29.59,20.92 U$6.13 29.59,20.92 | 29.59,20.92 | 29.59,20.92 30.6,20.92 30.6,21.55 v30.35,21.81 | R18.2 16.76,25.62 v16.89,25.74 | C10.2 v26.92,15.2 26.92,14.19 28.32,12.79 31.11,12.79 31.75,12.15 31.75,10.88 31.35,10.48 U$6.7 | C2.2 25.14,14.57 v25.78,15.2
  Bottom 0.305: 47.86,17.67 arc-36 46.97,18.92
  Bottom 0.406: 47.44,21.57 arc21 46.95,20.71
  Bottom 0.813: U$2.P$1 7.36,23.2 8.63,21.93 U$4.3
  other vias: 31.11,14.31 17.39,24.6 6.22,29.55 20.44,11.39 21.59,11.39 22.6,11.39 27.43,5.42 27.43,4.41 26.66,4.92 47.49,21.93 48.89,22.7 50.67,22.57 51.94,21.55 52.57,19.9 47.87,17.36 49.4,16.85 50.92,17.11 52.06,18.25 37.33,32.86 39.37,32.86 41.4,32.86 43.43,32.86 45.46,32.86 47.49,32.86 49.53,32.86 51.56,32.86 53.59,32.86 55.62,32.86 57.65,32.86 59.69,32.86 61.72,32.86 61.72,30.57 61.72,28.54 61.72,26.5 61.72,24.47 61.72,22.44 61.72,20.41 61.72,18.38 61.72,16.35 61.72,14.31 61.72,12.28 61.72,10.25 61.72,8.22 61.72,6.82 59.69,6.82 57.65,6.82 55.62,6.82 53.59,6.82 51.56,6.82 49.53,6.82 47.75,6.82 43.43,6.82 41.4,6.82 39.37,6.82 37.33,6.82 35.94,6.82 35.94,8.98 35.94,11.01 35.94,13.04 35.94,15.07 35.94,19.14 35.94,21.17 35.94,23.2 35.94,25.24 35.94,27.27 35.94,29.3 35.94,31.33 35.94,32.86 54.48,9.61 48.51,9.49 48.51,11.9 46.35,13.55 43.3,13.3 42.54,10.88 39.87,8.73 38.48,10.63 40.51,12.41 42.41,16.09 42.54,18.63 42.54,21.04 44.32,22.82 46.48,23.58 51.05,9.61 51.68,12.28 57.53,11.27 59.05,13.3 56.13,13.68 50.41,14.57 53.97,15.33 56,17.23 58.67,16.09 59.43,19.27 56.51,20.41 54.61,18.89 54.86,22.7 58.16,23.46 59.05,26.76 58.42,29.81 55.88,26.25 53.21,25.11 49.91,25.24 52.57,27.9 55.49,28.92 50.41,30.57 48.38,27.9 46.73,30.57 39.49,16.6 38.98,19.65 41.14,23.58 38.98,22.06 59.56,9.61 53.97,30.82 38.09,24.09 40.89,26.38 44.06,25.74 47.37,26 44.83,28.16 40.38,29.04 42.79,30.32 54.48,12.15 38.73,14.31
  pour Route2 (isolate 0.203): 0.63,34.84 33.78,34.84 33.78,0.65 0.66,0.65
  pour Bottom (no thermals): 20.06,14.82 20.06,18.12 22.73,18.12 22.73,14.82
  pour Bottom (no thermals): 20.06,14.31 22.86,14.31 22.86,11.14 20.06,11.14
  pour Top (no thermals): 25.52,12.54 25.52,15.2 26.79,15.2 26.79,12.54
  pour Top (no thermals): 25.52,12.54 25.52,15.46 29.97,15.46 29.97,12.79 27.17,12.79 26.92,12.54
  pour Top (no thermals): 30.73,12.79 30.73,14.57 31.49,14.57 31.49,12.79
  pour Bottom (no thermals): 5.84,27.01 5.84,29.81 7.36,29.81 7.36,27.01
  pour Bottom (no thermals): 15.62,26.63 20.57,26.63 20.57,24.85 18.28,24.85 18.28,20.79 17.77,20.28 14.35,20.28 14.35,21.04 16.63,21.04 17.01,21.43 17.01,24.6 16.76,24.85 15.62,24.85
  pour Bottom (no thermals): 5.08,24.09 8.12,24.09 8.12,21.93 5.08,21.93
  pour Top (no thermals): 29.97,9.23 31.36,9.23 31.36,6.95 28.57,4.15 26.16,4.15 26.16,5.68 28.44,5.68 29.97,7.2
  pour Bottom (isolate 0.203): 35.17,33.49 62.48,33.49 62.48,6.06 35.17,6.06
  pour Route15 (isolate 0.203, no thermals): 35.17,33.49 49.53,33.49 49.53,22.44 arc180 49.53,17.11 49.53,6.06 35.17,6.06
  pour Route15: 49.53,33.49 62.48,33.49 62.48,6.06 49.53,6.06 49.53,17.11 arc180 49.53,22.44
  pour Route2 (isolate 0.203): 35.17,33.49 49.53,33.49 49.53,22.44 arc180 49.53,17.11 49.53,6.06 35.17,6.06
  pour Route2 (isolate 0.203): 49.53,33.49 62.48,33.49 62.48,6.06 49.53,6.06 49.53,17.11 arc180 49.53,22.44
  pour Top (isolate 0.203): 35.17,33.49 49.53,33.49 49.53,22.44 arc180 49.53,17.11 49.53,6.06 35.17,6.06
  pour Top (isolate 0.203): 49.53,33.49 62.48,33.49 62.48,6.06 49.53,6.06 49.53,17.11 arc180 49.53,22.44
LED_1
  Top 0.203: FBW.60 20.24,20.46 20.32,20.54 22.22,20.54 22.47,20.28 22.47,19.01 22.98,18.5 24.89,18.5 26.79,20.41 LED1.C | LED1.C 27.81,20.41 | LED1.C 27.94,20.41
LED_2  (via drill 0.35)
  Top 0.203: FBW.4 14.7,25.47 15.11,25.87 15.11,27.39 v14.47,28.03 | 27.81,23.2 LED2.C 27.3,23.2 26.54,23.96 26.54,25.87 22.98,29.43 v22.47,29.43
  Bottom 0.203: v14.47,28.03 15.11,28.66 15.11,29.43 v22.47,29.43
LPC_CLOCK
  Top 0.203: FBW.61 22.43,20.96 23.36,20.03 23.36,19.63 U$19.P$1 23.73,19.27 24.38,19.27 C8_1.1
LPC_INT
  Top 0.203: SERIAL_2.7 8.98,32.83 8.25,32.09 7.11,32.09 6.73,31.71 6.73,30.32 6.6,30.19 5.84,30.19 5.58,29.93 5.58,29.17 7.36,27.39 7.36,25.36 7.74,24.98 7.74,23.08 8.88,21.93 8.88,16.22 8.13,15.46 FBW.31
LPC_MISO  (via drill 0.35)
  Top 0.203: FBW.53 17.12,16.96 16.76,16.6 14.73,16.6 11.93,19.39 11.55,19.39 10.92,20.03 10.92,21.17 8.7,23.38 FBW.16 8.7,26.43 v8.38,26.76
  Bottom 0.203: v8.38,26.76 8.38,30.06 7.62,30.82 6.85,30.82 5.23,32.44 SERIAL_2.4
LPC_MOSI  (via drill 0.35)
  Top 0.203: FBW.54 16.99,17.46 16.51,16.98 14.98,16.98 12.19,19.77 11.81,19.77 11.3,20.28 11.3,22.06 v11.81,22.57
  Bottom 0.203: v11.81,22.57 11.93,22.7 11.93,29.81 11.04,30.7 8.38,30.7 7.74,31.33 6.98,31.33 6.48,31.83 SERIAL_2.5
LPC_P0.14  (via drill 0.35)
  Top 0.203: FBW.41 v12.7,14.43 v12.7,14.44
  Bottom 0.203: v12.7,14.44 12.19,14.95 7.11,14.95 5.58,16.47 5.58,17.49 5.33,17.74 4.69,17.74 4.06,18.38 4.06,18.49 R16.2 | R16.2 3.93,18.63 | R16.2 3.42,19.12 3.42,19.39 2.54,20.28 2.53,20.27 SERIAL_1.5
LPC_P0.23  (via drill 0.35)
  Top 0.203: v13.2,22.31 12.57,21.68 12.57,21.04 14.15,19.46 FBW.58
  Bottom 0.203: R17.2 13.46,27.78 13.84,27.39 R18.1 13.58,25.62 13.58,24.35 13.2,23.96 v13.2,22.31
LPC_RESET  (via drill 0.35)
  Top 0.203: FBW.57 16.58,18.96 v15.62,18
  Bottom 0.203: v15.62,18 15.87,17.74 15.87,14.31 15.62,14.06 13.84,14.06 13.33,14.57 13.33,14.82 12.82,15.33 7.23,15.33 5.96,16.6 5.96,19.77 5.49,20.25 4.95,20.25 | 4.95,20.25 3.8,20.25 R4.1 3.57,20.52 2.54,21.55 2.15,21.55 SERIAL_1.6 | 4.95,20.25 C1_1.2
LPC_RXD_0
  Top 0.203: FBW.21 6.04,20.46 5.58,20.92 5.58,21.17 5.33,21.43 3.93,21.43 2.54,22.82 2.15,22.82 SERIAL_1.7
LPC_RXD_1  (via drill 0.35)
  Top 0.203: FBW.34 9.2,12.09 10.41,10.88 12.06,10.88 12.19,10.76 23.87,10.76 24.51,10.12 24.51,8.85 v24.38,8.73
  Bottom 0.203: U$6.3 28.16,6.09 26.92,7.33 25.27,7.33 24.38,8.22 v24.38,8.73
LPC_SCK  (via drill 0.35)
  Top 0.203: FBW.47 15.7,14.23 v15.11,14.82 | v8,25.74 8.25,25.49 8.25,23.2 10.54,20.92 10.54,19.77 v13.84,16.47
  Bottom 0.203: v8,25.74 7.74,26 7.74,29.93 7.36,30.32 6.6,30.32 3.98,32.93 SERIAL_2.3 | v13.84,16.47 15.11,15.2 v15.11,14.82
LPC_SCL0
  Top 0.203: R14.2 4.93,20.78 4.95,20.79 5.77,19.96 FBW.22 | R14.2 4.82,20.79 | R14.2 4.17,20.78 2.41,19.01 SERIAL_1.4
LPC_SDA0
  Top 0.203: FBW.26 5.93,17.96 4.46,16.49 R13.2 | R13.2 3.93,16.47 arc90 3.9,16.5 | R13.2 3.93,16.35 2.51,17.77 SERIAL_1.3
LPC_SSEL  (via drill 0.35)
  Top 0.203: FBW.55 16.85,17.96 16.25,17.36 15.24,17.36 v12.06,20.54
  Bottom 0.203: SERIAL_2.6 7.73,32.74 9.27,31.2 11.3,31.2 12.44,30.06 12.44,28.28 13.46,27.27 13.46,26.63 13.2,26.38 13.2,24.6 12.44,23.84 12.44,22.19 12.06,21.81 v12.06,20.54
LPC_TXD_0
  Top 0.203: FBW.19 5.92,21.46 5.71,21.68 5.71,22.44 5.33,22.82 4.82,22.82 3.68,23.96 2.15,23.96 SERIAL_1.8
LPC_TXD_1  (via drill 0.35)
  Top 0.203: FBW.33 8.7,11.83 10.03,10.5 11.81,10.5 11.93,10.38 23.62,10.38 23.87,10.12 v23.87,9.74
  Bottom 0.203: U$6.4 29.59,7.2 27.81,7.2 27.17,7.84 25.4,7.84 25.01,8.22 25.01,8.98 24.25,9.74 v23.87,9.74
LPC_USB_CONNECT
  Top 0.203: FBW.17 6.85,22.44 | FBW.17 | FBW.17 6.85,23.33 2.92,27.27 2.92,28.66 2.91,28.66 Q1.B 2.92,28.55
LPC_USB_N  (via drill 0.35)
  Top 0.203: FBW.11 11.2,25.71 v11.04,25.87 | C7.1 12.03,30.06 11.17,30.06 R10.2 11.16,30.06 v10.15,30.06
  Bottom 0.203: v10.15,30.06 10.66,29.55 10.66,26.25 v11.04,25.87
LPC_USB_P  (via drill 0.35)
  Top 0.203: v11.3,29.04 10.14,29.04 R9.2 9.14,30.06 8,30.06 | FBW.10 11.7,26.48 v11.3,26.89 | C3.1 8,30.06 | R11.2 7.38,30.68 8,30.06
  Bottom 0.203: v11.3,29.04 v11.3,26.89
N$1
  Bottom 0.203: U$6.6 29.59,8.34 | U$6.5 29.59,8.34 | 29.59,8.34 27.94,8.34 27.05,9.23 26.28,9.23 L2.1 25.89,9.25 25.14,10 C2.1
N$2
  Bottom 0.406: 49.6,18.81 49.6,18.83
N$3
  Bottom 0.813: U$15.P$1 49.53,19.77 49.51,19.79 U$6.16
N$4
  Bottom 0.203: R17.1 13.46,30.7 12.73,31.42 SERIAL_2.10
N$5
  Top 0.203: FBW.62 20.35,21.46 21.2,22.31 21.2,23.46 | 21.2,23.46 21.18,23.46 | C9_1.1 24.38,22.95 | 21.2,23.46 21.2,23.35 U$19.P$3 | 21.2,23.46 22.22,22.44 24.38,22.44 C9_1.1 | C9_1.1 24.38,22.7
N$6
  Bottom 0.61: 9.65,25.39 9.65,25.49 | U$4.4 9.65,23.78 9.65,25.39 | 9.65,28.05 9.65,28.16 | 9.65,28.05 C4.1 | C6.1 9.65,25.39 | 9.65,25.39 9.65,28.05
N$7
  Top 0.203: 6.09,30.95 R11.1 3.86,30.95 Q1.C
N$8
  Bottom 0.406: R1.2 C6.2
N$9
  pour Bottom (no thermals): 6.47,20.28 8.12,20.28 8.63,19.77 12.82,19.77 12.82,15.71 7.49,15.71 6.47,16.73
N$10
  Bottom 0.203: U$4.5 14.35,23.2 13.97,22.82 13.97,18.89 14.22,18.63 17.01,18.63 17.14,18.5 17.14,16.35 17.39,16.09 17.9,16.09 | R6.2 17.9,16.09 | R5.1 17.9,16.09
  Bottom 0.406: U$4.5 15.49,23.2
N$11
  Top 0.203: R20.2 13.73,8.47 14.98,8.47 R19.1 14.98,6.95 16,5.93 U$1.4
N$13
  Top 0.61: 22.09,5.93 21.33,5.93 | X4.2 25.27,3.77 23.11,5.93 22.09,5.93 | 22.15,9.74 U$1.5 22.09,5.93
N$21
  Top 0.203: R2.2 29.46,19.01 29.87,19.43 LED1.A
N$22
  Top 0.203: R3.2 29.46,21.81 29.87,22.22 LED2.A
N$28
  Bottom 0.203: R12.1 29.6,26.36 30.09,25.87 31.87,25.87 31.87,26 | 31.87,26 C77.PLUS | C10.1 26.92,17.61 26.95,17.59 U$6.11 31.46,17.59 31.87,18 31.87,26
N$29
  Bottom 0.203: R12.2 28.82,27.65 28.11,28.37 D1.3
POWER_CTL  (via drill 0.35)
  Top 0.203: FBW.37 10.7,11.52 v10.79,11.52 | 13.71,9.74 13.33,9.74 | 13.71,9.74 R20.1 | v12.82,9.11 13.46,9.74 13.71,9.74
  Bottom 0.203: v10.79,11.52 10.79,9.49 11.17,9.11 v12.82,9.11
PPM_IN  (via drill 0.35)
  Top 0.203: FBW.30 5.84,15.96 5.71,15.84 5.71,11.14 v5.84,11.01
  Bottom 0.203: v5.84,11.01 4.44,9.61 X3.3
SERV_0
  Top 0.203: U$5.5 4.62,7.38 4.31,7.07 4.31,5.17 4.69,4.79 8,4.79 8.76,4.03 X9.3
SERV_1
  Top 0.203: U$5.4 4.51,8.03 3.8,7.33 3.8,4.92 4.69,4.03 5.46,4.03 X8.3
SERV_2
  Top 0.203: U$5.3 4.27,8.68 3.3,7.71 3.3,4.79 2.54,4.03 2.15,4.03 X1.3
SERV_3
  Top 0.203: U$5.15 10.31,9.33 9.77,9.87 9.14,9.87 8.88,9.61 8.88,6.95 9.77,6.06 11.04,6.06 U$5.10 11.78,6.08 12.06,5.8 X12.3
SERV_4
  Top 0.203: X10.3 20.34,4.01 19.43,4.92 17.01,4.92 16.63,5.3 14.85,5.3 12.12,8.03 U$5.13
SERV_5
  Top 0.203: X11.3 17.03,4.01 16.25,4.79 14.6,4.79 12,7.38 U$5.12
SERV_6
  Top 0.203: U$5.11 11.89,6.73 14.6,4.03 15.36,4.03 X2.3
SERV_CLK  (via drill 0.35)
  Top 0.203: FBW.29 6.73,16.46 6.73,16.47 5.71,16.47 5.21,15.96 U$5.1 5.97,9.98 6.35,9.61 v6.35,7.84 | U$5.9 10.28,5.42 v9.77,4.92
  Bottom 0.203: v6.35,7.84 6.98,7.2 6.98,5.55 7.62,4.92 v9.77,4.92
SERV_DATA
  Top 0.203: U$5.7 6.37,6.08 7.49,7.2 7.49,13.3 8.5,14.31 10.03,14.31 10.2,14.14 FBW.36
SERV_RESET  (via drill 0.35)
  Top 0.203: U$5.6 6.13,6.73 6.98,7.58 6.98,10.25 | U$5.14 10.07,8.68 v9.52,9.23 | 6.85,14.95 FBW.32 6.87,14.95 6.98,14.95 6.98,10.25 | 6.98,10.25 v6.73,10.25
  Bottom 0.203: v9.52,9.23 7.74,9.23 v6.73,10.25
USB+
  Top 0.203: SERIAL_2.8 10.23,32.81 9.14,31.71 R9.1 9.14,31.33
USB-
  Top 0.203: SERIAL_2.9 11.48,32.28 11.17,31.97 R10.1 11.17,31.33
VBAT
  Top 0.203: R7.2 18.16,29.55 18.92,28.79 JP1.2
  pour Bottom (no thermals): 15.62,28.92 21.08,28.92 22.73,27.27 22.73,21.17 20.57,19.01 14.35,19.01 14.35,19.77 18.03,19.77 18.92,20.66 18.92,24.35 20.95,24.35 20.95,26.89 20.7,27.14 15.62,27.14
VBAT_MEAS
  Top 0.203: FBW.1 16.2,25.41 15.87,25.74 15.87,28.03 16.52,28.03 R15.2 | R15.2 16.63,27.9 | R15.2 16.63,28.03 16.62,28.04 R7.1

### Text on the board
tDocu: SERIAL 2 | ANALOG | L2 | L1 | SERIAL 1 | RC | Paparazzi Tiny13 V1.1 | by Martin & Poine | S2 | S1 | S0 | S3 | S6 | S5 | S4